# EAGLE design buffer (EAGLE 6.1)
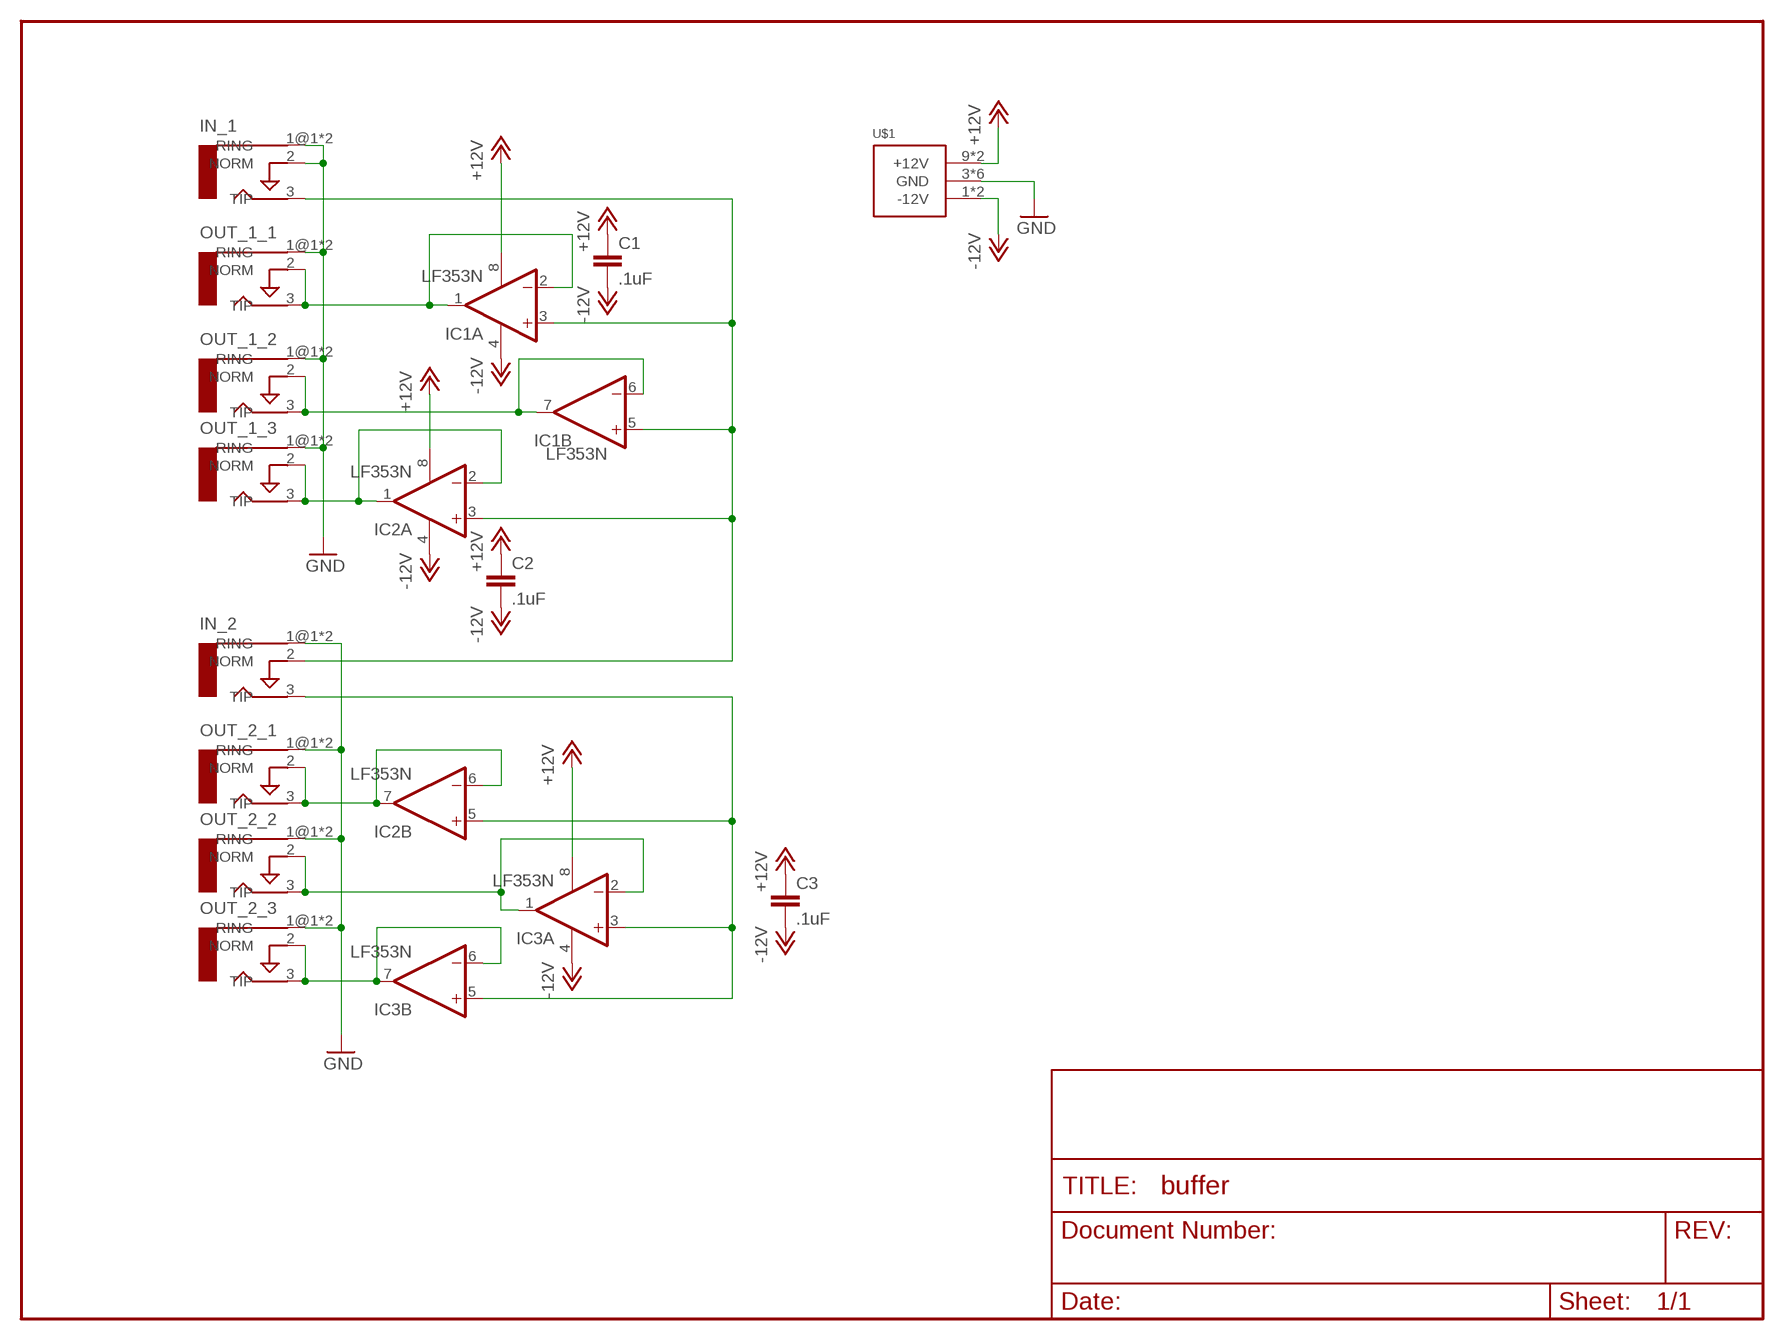
[diagram p0: schematic, sheet 1]

## Parts
C1  .1uF  CAPPTH  [CAP-PTH-SMALL]
C2  .1uF  CAPPTH  [CAP-PTH-SMALL]
C3  .1uF  CAPPTH  [CAP-PTH-SMALL]
IC1  LF353N  [DIL08]
IC2  LF353N  [DIL08]
IC3  LF353N  [DIL08]
IN_1  AUDIO-JACKERTHENVAR  [ERTHENVAR-JACK]
IN_2  AUDIO-JACKERTHENVAR  [ERTHENVAR-JACK]
OUT_1_1  AUDIO-JACKERTHENVAR  [ERTHENVAR-JACK]
OUT_1_2  AUDIO-JACKERTHENVAR  [ERTHENVAR-JACK]
OUT_1_3  AUDIO-JACKERTHENVAR  [ERTHENVAR-JACK]
OUT_2_1  AUDIO-JACKERTHENVAR  [ERTHENVAR-JACK]
OUT_2_2  AUDIO-JACKERTHENVAR  [ERTHENVAR-JACK]
OUT_2_3  AUDIO-JACKERTHENVAR  [ERTHENVAR-JACK]
U$1  POWER_SIMPLE16  [POWER_16]

## Nets
+12V: C1.1 C2.1 C3.1 IC1.8(P:V+) IC2.8(P:V+) IC3.8(P:V+) U$1.9(+12V) U$1.10(+12V)
-12V: C1.2 C2.2 C3.2 IC1.4(P:V-) IC2.4(P:V-) IC3.4(P:V-) U$1.1(-12V) U$1.2(-12V)
GND: IN_1.1@1(RING) IN_1.1@2(RING) IN_1.2(NORM) IN_2.1@1(RING) IN_2.1@2(RING) OUT_1_1.1@1(RING) OUT_1_1.1@2(RING) OUT_1_2.1@1(RING) OUT_1_2.1@2(RING) OUT_1_3.1@1(RING) OUT_1_3.1@2(RING) OUT_2_1.1@1(RING) OUT_2_1.1@2(RING) OUT_2_2.1@1(RING) OUT_2_2.1@2(RING) OUT_2_3.1@1(RING) OUT_2_3.1@2(RING) U$1.3(GND) U$1.4(GND) U$1.5(GND) U$1.6(GND) U$1.7(GND) U$1.8(GND)
N$1: IC1.1(A:OUT) IC1.2(A:-IN) OUT_1_1.2(NORM) OUT_1_1.3(TIP)
N$3: IC2.1(A:OUT) IC2.2(A:-IN) OUT_1_3.2(NORM) OUT_1_3.3(TIP)
N$4: IC1.6(B:-IN) IC1.7(B:OUT) OUT_1_2.2(NORM) OUT_1_2.3(TIP)
N$10: IC1.3(A:+IN) IC1.5(B:+IN) IC2.3(A:+IN) IN_1.3(TIP) IN_2.2(NORM)
N$11: IC2.6(B:-IN) IC2.7(B:OUT) OUT_2_1.2(NORM) OUT_2_1.3(TIP)
N$12: IC3.6(B:-IN) IC3.7(B:OUT) OUT_2_3.2(NORM) OUT_2_3.3(TIP)
N$13: IC2.5(B:+IN) IC3.3(A:+IN) IC3.5(B:+IN) IN_2.3(TIP)
N$15: IC3.1(A:OUT) IC3.2(A:-IN) OUT_2_2.2(NORM) OUT_2_2.3(TIP)

## Library data of the parts
C1-C3 = SparkFun:CAP: Capacitor Standard 0603 ceramic capacitor, and 0.1" leaded capacitor.
IC1-IC3 = linear:LF353: OP AMP
IN_1 IN_2 OUT_1_1-OUT_1_3 OUT_2_1-OUT_2_3 = erthenvar:AUDIO-JACK: Switching Mono 3.5mm Audio Jack from Erthenvar.
U$1 = eurorack:POWER_SIMPLE

## Board
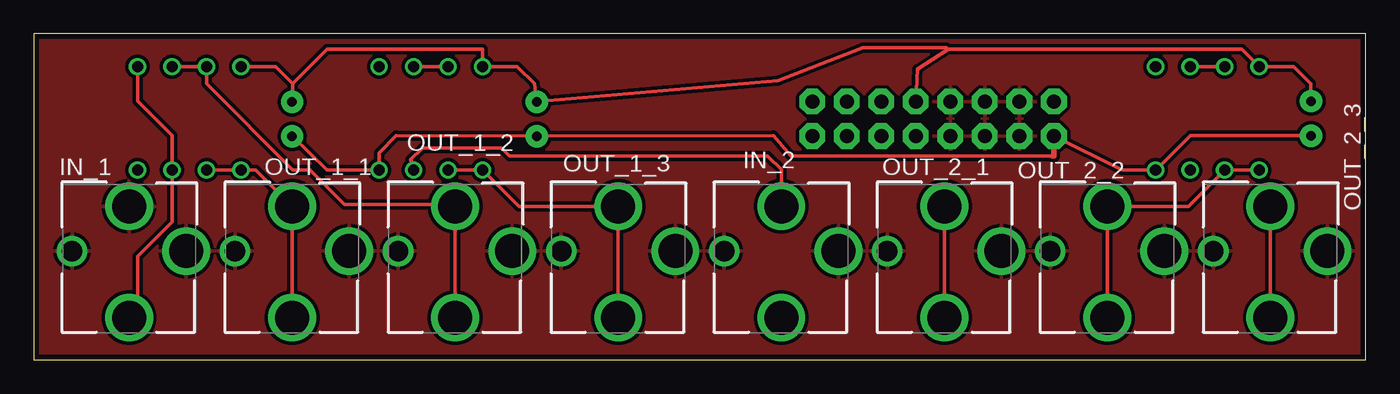
[diagram p1: board, top side]
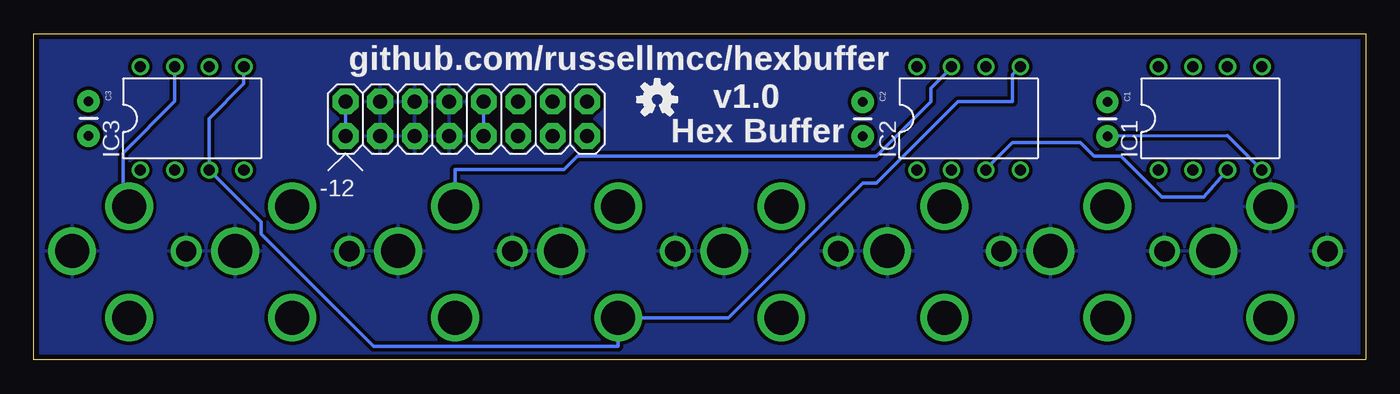
[diagram p2: board, bottom side, seen from below]

Size 98 x 24 mm. Coordinates in mm from the lower left corner, seen from the top.
Outline: 0,0 98,0 98,24 0,24 0,0
Copper layers (1*16): Top 0.0356mm / dielectric 1.5011mm / Bottom 0.0356mm
Design rules "default": minimum track width 6mil, minimum drill 13mil, track to track 6mil, track to pad 6mil, pad to pad 6mil, via to via 6mil, smd to smd 6mil, copper to edge 15mil, drill to drill 6mil, minimum pad ring 7mil, minimum via ring 7mil, stop-mask expansion 4mil, vias tented up to drill 0mil, thermal gap 10mil

### Footprints (pad centres in the part's own frame; a part is rotated, then mirrored left to right if it is on the bottom)
CAP-PTH-SMALL = drill 0.7 pad 1.651: 1 0,0; 2 2.54,0
DIL08 = drill 0.813 pad 1.27: 1 -3.81,-3.81; 2 -1.27,-3.81; 3 1.27,-3.81; 4 3.81,-3.81; 5 3.81,3.81; 6 1.27,3.81; 7 -1.27,3.81; 8 -3.81,3.81
ERTHENVAR-JACK = drill 2.5: 1@1 -4.2,0; 2 0,-3.3; 3 0,4.9 | drill 1.5: 1@2 4.2,0
POWER_16 = drill 1.016 pad 1.88 octagon: 1 -6.35,-1.27; 2 -6.35,1.27; 3 -3.81,-1.27; 4 -3.81,1.27; 5 -1.27,-1.27; 6 -1.27,1.27; 7 1.27,-1.27; 8 1.27,1.27; 9 3.81,-1.27; 10 3.81,1.27; 11 6.35,-1.27; 12 6.35,1.27; 13 8.89,-1.27; 14 8.89,1.27; 15 11.43,-1.27; 16 11.43,1.27

### Placement (x,y rotation side)
C1  19,19 270 bottom
C2  37,19 270 bottom
C3  93.98,19.05 270 bottom
IC1  11.43,17.78 0 bottom
IC2  29.21,17.78 0 bottom
IC3  86.36,17.78 0 bottom
IN_1  7,8 180 top
IN_2  55,8 180 top
OUT_1_1  19,8 180 top
OUT_1_2  31,8 180 top
OUT_1_3  43,8 180 top
OUT_2_1  67,8 180 top
OUT_2_2  79,8 180 top
OUT_2_3  91,8 180 top
U$1  68.71,17.75 0 bottom
U$6  [OSHW-LOGO-S]  52.13,19.18 0 bottom

### Tracks (layer width: path | path; a pad name or v marks a point on that pad's centre or on a via)
+12V
  Top 0.254: C3.1 93.98,20.32 92.71,21.59 IC3.8 88.9,22.86 67.31,22.86 | C1.1 19.05,20.32 | 19.05,20.32 17.78,21.59 IC1.8 | 67.31,22.86 65.02,21.42 U$1.10 | 19.05,20.32 21.59,22.86 33.02,22.86 IC2.8 35.56,21.59 36.83,20.32 C2.1 54.76,20.57 61,23 67.17,23 67.31,22.86
  Bottom 0.254: U$1.10 U$1.9
-12V
  Top 0.254: C3.2 85.09,16.51 IC3.4 80.11,13.97 U$1.1 | C1.2 21.59,13.97 IC2.4 25.4,15.24 26.67,16.51 C2.2 54.44,16.51 55.7,15 74.97,15
  Top 0.406: 74.97,15 75.06,15 U$1.1
  Bottom 0.254: U$1.2 U$1.1 | IC1.4 10.16,16.51 C1.2
GND
  pour Bottom (isolate 0.254): 0,24 0,0 98,0 98,24
  pour Top (isolate 0.254): 0,24 98,24 98,0 0,0
N$1
  Top 0.254: OUT_1_1.3 OUT_1_1.2 16.33,13.97 IC1.1 IC1.2
N$3
  Top 0.254: OUT_1_3.3 OUT_1_3.2 35.69,11.3 IC2.1 IC2.2
  Bottom 0.254: 43.4,11.3 OUT_1_3.2
N$4
  Top 0.254: OUT_1_2.3 OUT_1_2.2 30.87,11.43 22.86,11.43 20.32,13.97 19.05,13.97 12.7,20.32 IC1.7 IC1.6
N$10
  Top 0.254: IN_1.3 7.62,3.72 7.62,7.62 10.16,10.16 IC1.3 10.16,16.51 7.62,19.05 IC1.5 | IC2.3 27.73,14.73 28.6,15.6 34.4,15.6 35,15 54,15 55,14 IN_2.2 55,11
  Bottom 0.254: IC2.3 27.73,14.27 26,16 21,16 20,15 18,15 15,12 11.92,12 IC1.3
N$11
  Top 0.254: OUT_2_1.2 OUT_2_1.3 | IC2.6 IC2.7
  Bottom 0.254: 67,11 OUT_2_1.2 67,14 59,14 58,15 36,15 32,19 32,20 30.48,21.52 IC2.7
N$12
  Top 0.254: OUT_2_3.2 OUT_2_3.3 | IC3.6 IC3.7
  Bottom 0.254: IC3.7 87.63,19.05 91.44,15.24 91.44,11.74 OUT_2_3.2
N$13
  Bottom 0.254: IC3.5 82.55,20.32 85.09,17.78 IC3.3 81.28,10.16 81.28,9.28 73,1 55,1 IN_2.3 46.9,3.1 37,13 36,13 30,19 26,19 26,20.99 IC2.5
N$15
  Top 0.254: OUT_2_2.3 OUT_2_2.2 84.96,11.3 IC3.2 IC3.1

### Text on the board
bPlace: github.com/russellmcc/hexbuffer | v1.0 | Hex Buffer